# EAGLE schematic item_2022_02 (EAGLE 9.6.2)

## Sheet 1 of 2
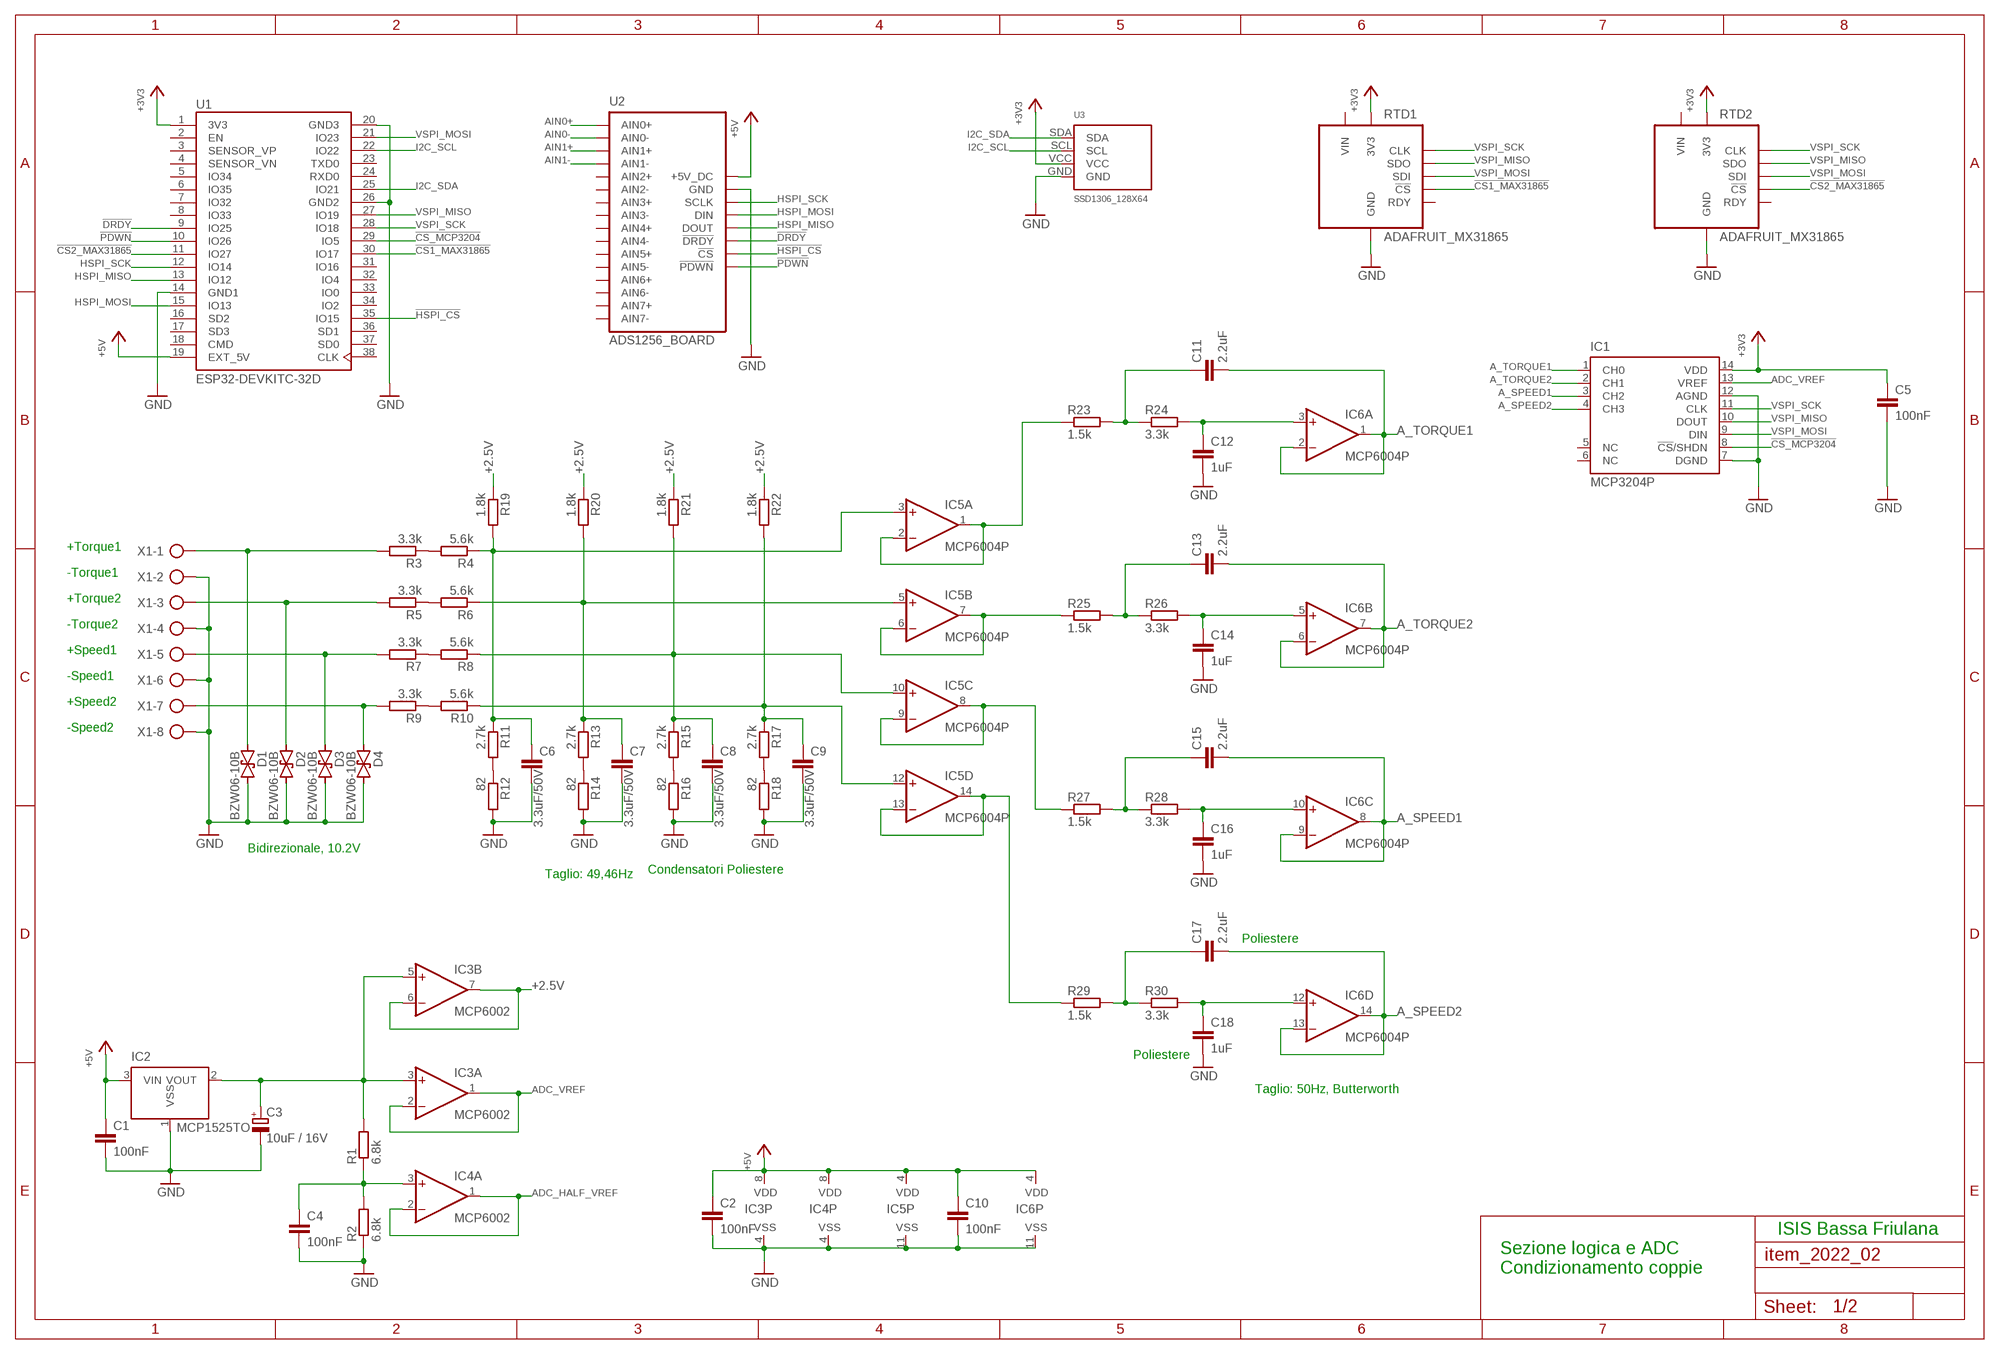
[diagram p0: schematic, sheet 1]

### Parts
C1  100nF  C-EU050-025X075  [C050-025X075]
C2  100nF  C-EU050-025X075  [C050-025X075]
C3  10uF / 16V  CPOL-EUE2.5-6  [E2,5-6]
C4  100nF  C-EU050-025X075  [C050-025X075]
C5  100nF  C-EU050-025X075  [C050-025X075]
C6  3.3uF/50V  C-EU050-030X075  [C050-030X075]
C7  3.3uF/50V  C-EU050-030X075  [C050-030X075]
C8  3.3uF/50V  C-EU050-030X075  [C050-030X075]
C9  3.3uF/50V  C-EU050-030X075  [C050-030X075]
C10  100nF  C-EU050-025X075  [C050-025X075]
C11  2.2uF  C-EU050-030X075  [C050-030X075]
C12  1uF  C-EU050-030X075  [C050-030X075]
C13  2.2uF  C-EU050-030X075  [C050-030X075]
C14  1uF  C-EU050-030X075  [C050-030X075]
C15  2.2uF  C-EU050-030X075  [C050-030X075]
C16  1uF  C-EU050-030X075  [C050-030X075]
C17  2.2uF  C-EU050-030X075  [C050-030X075]
C18  1uF  C-EU050-030X075  [C050-030X075]
D1  BZW06-10B  BZW04XXB  [F126Z12]
D2  BZW06-10B  BZW04XXB  [F126Z12]
D3  BZW06-10B  BZW04XXB  [F126Z12]
D4  BZW06-10B  BZW04XXB  [F126Z12]
IC1  MCP3204P  [DIL14]
IC2  MCP1525TO  [TO92]
IC3  MCP6002  [DIL08]
IC4  MCP6002  [DIL08]
IC5  MCP6004P  [DIL14]
IC6  MCP6004P  [DIL14]
R1  6.8k  R-EU_0207/10  [0207/10]
R2  6.8k  R-EU_0207/10  [0207/10]
R3  3.3k  R-EU_0207/10  [0207/10]
R4  5.6k  R-EU_0207/10  [0207/10]
R5  3.3k  R-EU_0207/10  [0207/10]
R6  5.6k  R-EU_0207/10  [0207/10]
R7  3.3k  R-EU_0207/10  [0207/10]
R8  5.6k  R-EU_0207/10  [0207/10]
R9  3.3k  R-EU_0207/10  [0207/10]
R10  5.6k  R-EU_0207/10  [0207/10]
R11  2.7k  R-EU_0207/10  [0207/10]
R12  82  R-EU_0207/10  [0207/10]
R13  2.7k  R-EU_0207/10  [0207/10]
R14  82  R-EU_0207/10  [0207/10]
R15  2.7k  R-EU_0207/10  [0207/10]
R16  82  R-EU_0207/10  [0207/10]
R17  2.7k  R-EU_0207/10  [0207/10]
R18  82  R-EU_0207/10  [0207/10]
R19  1.8k  R-EU_0207/10  [0207/10]
R20  1.8k  R-EU_0207/10  [0207/10]
R21  1.8k  R-EU_0207/10  [0207/10]
R22  1.8k  R-EU_0207/10  [0207/10]
R23  1.5k  R-EU_0207/10  [0207/10]
R24  3.3k  R-EU_0207/10  [0207/10]
R25  1.5k  R-EU_0207/10  [0207/10]
R26  3.3k  R-EU_0207/10  [0207/10]
R27  1.5k  R-EU_0207/10  [0207/10]
R28  3.3k  R-EU_0207/10  [0207/10]
R29  1.5k  R-EU_0207/10  [0207/10]
R30  3.3k  R-EU_0207/10  [0207/10]
RTD1  ADAFRUIT_MX31865  [ADAFRUIT_MAX31865]
RTD2  ADAFRUIT_MX31865  [ADAFRUIT_MAX31865]
U1  ESP32-DEVKITC-32D  [MODULE_ESP32-DEVKITC-32D]
U2  ADS1256_BOARD  [ADS1256_BOARD]
U3  SSD1306_128X64  [128X64]
X1  AK500/8  [AK500/8]

### Nets
!CS1_MAX31865!: RTD1.P7(!CS!) U1.30(IO17)
!CS2_MAX31865!: RTD2.P7(!CS!) U1.11(IO27)
!CS_MCP3204!: IC1.8(!CS!/SHDN) U1.29(IO5)
!DRDY!: U1.9(IO25) U2.!DRDY!
!HSPI_CS!: U1.35(IO15) U2.!CS!
!PDWN!: U1.10(IO26) U2.PDWN(!PDWN!)
+2.5V: IC3.6(B:-IN) IC3.7(B:OUT) R19.1 R20.1 R21.1 R22.1
+3V3: C5.1 IC1.14(VDD) RTD1.P3(3V3) RTD2.P3(3V3) U1.1(3V3) U3.VCC
+5V: C1.1 C2.1 C10.1 IC2.3(VIN) IC3.8(P:VDD) IC4.8(P:VDD) IC5.4(P:VDD) IC6.4(P:VDD) U1.19(EXT_5V) U2.5V_DC(+5V_DC)
A_SPEED1: C15.2 IC1.3(CH2) IC6.8(C:OUT) IC6.9(C:-IN)
A_SPEED2: C17.2 IC1.4(CH3) IC6.13(D:-IN) IC6.14(D:OUT)
A_TORQUE1: C11.2 IC1.1(CH0) IC6.1(A:OUT) IC6.2(A:-IN)
A_TORQUE2: C13.2 IC1.2(CH1) IC6.6(B:-IN) IC6.7(B:OUT)
ADC_HALF_VREF: IC4.1(A:OUT) IC4.2(A:-IN)
ADC_VREF: IC1.13(VREF) IC3.1(A:OUT) IC3.2(A:-IN)
AIN0+: U2.AIN0+
AIN0-: U2.AIN0-
AIN1+: U2.AIN1+
AIN1-: U2.AIN1-
GND: C1.2 C2.2 C3.- C4.2 C5.2 C6.2 C7.2 C8.2 C9.2 C10.2 C12.2 C14.2 C16.2 C18.2 D1.C D2.C D3.C D4.C IC1.7(DGND) IC1.12(AGND) IC2.1(VSS) IC3.4(P:VSS) IC4.4(P:VSS) IC5.11(P:VSS) IC6.11(P:VSS) R2.1 R12.2 R14.2 R16.2 R18.2 RTD1.P2(GND) RTD2.P2(GND) U1.14(GND1) U1.20(GND3) U1.26(GND2) U2.GND U3.GND X1.2 X1.4 X1.6 X1.8
HSPI_MISO: U1.13(IO12) U2.DOUT
HSPI_MOSI: U1.15(IO13) U2.DIN
HSPI_SCK: U1.12(IO14) U2.SCLK
I2C_SCL: U1.22(IO22) U3.SCL
I2C_SDA: U1.25(IO21) U3.SDA
N$1: C3.+ IC2.2(VOUT) IC3.3(A:+IN) IC3.5(B:+IN) R1.2
N$2: D1.A R3.2 X1.1
N$3: C4.1 IC4.3(A:+IN) R1.1 R2.2
N$4: D2.A R5.2 X1.3
N$5: D3.A R7.2 X1.5
N$6: D4.A R9.2 X1.7
N$7: R3.1 R4.2
N$8: R5.1 R6.2
N$9: R7.1 R8.2
N$10: R9.1 R10.2
N$11: R11.2 R12.1
N$12: C6.1 IC5.3(A:+IN) R4.1 R11.1 R19.2
N$13: R13.2 R14.1
N$14: R15.2 R16.1
N$15: R17.2 R18.1
N$16: C7.1 IC5.5(B:+IN) R6.1 R13.1 R20.2
N$17: C8.1 IC5.10(C:+IN) R8.1 R15.1 R21.2
N$18: C9.1 IC5.12(D:+IN) R10.1 R17.1 R22.2
N$19: IC5.1(A:OUT) IC5.2(A:-IN) R23.1
N$20: IC5.6(B:-IN) IC5.7(B:OUT) R25.1
N$21: IC5.8(C:OUT) IC5.9(C:-IN) R27.1
N$22: IC5.13(D:-IN) IC5.14(D:OUT) R29.1
N$23: C11.1 R23.2 R24.1
N$24: C12.1 IC6.3(A:+IN) R24.2
N$26: C13.1 R25.2 R26.1
N$27: C14.1 IC6.5(B:+IN) R26.2
N$29: C15.1 R27.2 R28.1
N$30: C16.1 IC6.10(C:+IN) R28.2
N$32: C17.1 R29.2 R30.1
N$33: C18.1 IC6.12(D:+IN) R30.2
VSPI_MISO: IC1.10(DOUT) RTD1.P5(SDO) RTD2.P5(SDO) U1.27(IO19)
VSPI_MOSI: IC1.9(DIN) RTD1.P6(SDI) RTD2.P6(SDI) U1.21(IO23)
VSPI_SCK: IC1.11(CLK) RTD1.P4(CLK) RTD2.P4(CLK) U1.28(IO18)
Unconnected: IC1.5(NC) IC1.6(NC) IC4.5(B:+IN) IC4.6(B:-IN) IC4.7(B:OUT) RTD1.P8(RDY) RTD2.P8(RDY) U1.2(EN) U1.3(SENSOR_VP) U1.4(SENSOR_VN) U1.5(IO34) U1.6(IO35) U1.7(IO32) U1.8(IO33) U1.16(SD2) U1.17(SD3) U1.18(CMD) U1.23(TXD0) U1.24(RXD0) U1.31(IO16) U1.32(IO4) U1.33(IO0) U1.34(IO2) U1.36(SD1) U1.37(SD0) U1.38(CLK) U2.AIN2+ U2.AIN2- U2.AIN3+ U2.AIN3- U2.AIN4+ U2.AIN4- U2.AIN5+ U2.AIN5- U2.AIN6+ U2.AIN6- U2.AIN7+ U2.AIN7-

### Notes on the sheet
- +Torque1
- -Torque1
- +Torque2
- -Torque2
- +Speed1
- -Speed1
- +Speed2
- -Speed2
- Bidirezionale, 10.2V
- Taglio: 49,46Hz | Condensatori Poliestere
- Poliestere
- Poliestere
- Taglio: 50Hz, Butterworth
- ISIS Bassa Friulana
- Sezione logica e ADC
  Condizionamento coppie

## Sheet 2 of 2
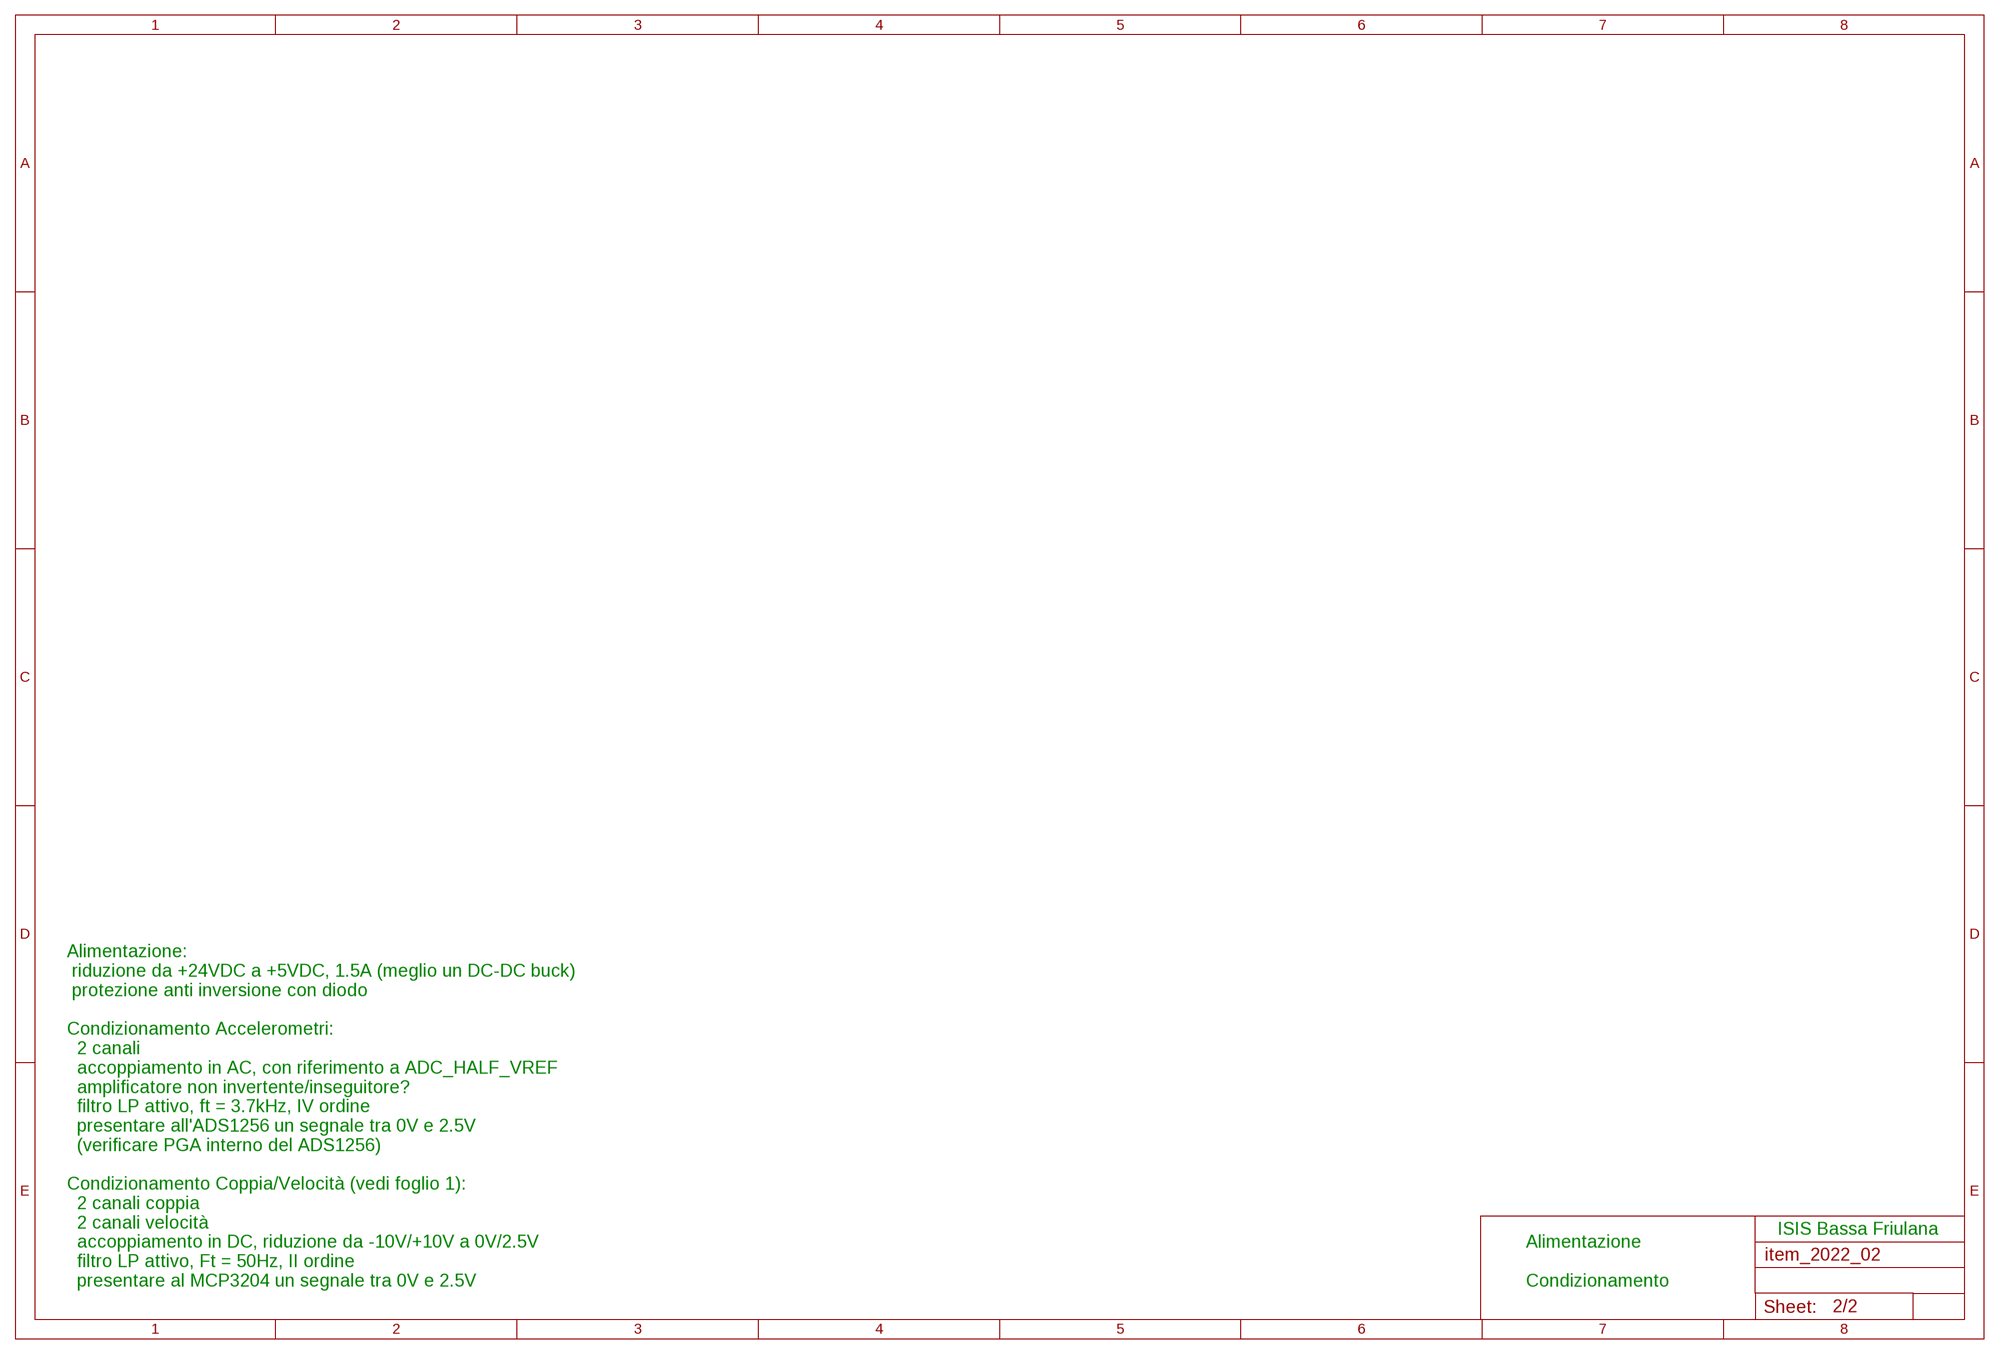
[diagram p1: schematic, sheet 2]

### Notes on the sheet
- ISIS Bassa Friulana
- Alimentazione:
   riduzione da +24VDC a +5VDC, 1.5A (meglio un DC-DC buck)
   protezione anti inversione con diodo
  
  Condizionamento Accelerometri:
    2 canali
    accoppiamento in AC, con riferimento a ADC_HALF_VREF
    amplificatore non invertente/inseguitore?
    filtro LP attivo, ft = 3.7kHz, IV ordine
    presentare all'ADS1256 un segnale tra 0V e 2.5V
    (verificare PGA interno del ADS1256)
  
  Condizionamento Coppia/Velocità (vedi foglio 1):
    2 canali coppia
    2 canali velocità
    accoppiamento in DC, riduzione da -10V/+10V a 0V/2.5V
    filtro LP attivo, Ft = 50Hz, II ordine
    presentare al MCP3204 un segnale tra 0V e 2.5V
- Alimentazione
  
  Condizionamento

## Power pins joined to a net without a drawn wire
VIN: RTD1.P1(VIN) RTD2.P1(VIN)

## Library data of the parts
C1 C2 C4 C5 C10 = rcl_LargePads:C-EU: CAPACITOR, European symbol
C3 = rcl_LargePads:CPOL-EU: POLARIZED CAPACITOR, European symbol
C6-C9 = rcl_LargePads:C-EU: CAPACITOR, European symbol; TME_EU: MKS2B043301H00KSSD
C11 C13 C15 C17 = rcl_LargePads:C-EU: CAPACITOR, European symbol; TME_EU: MKS2B042201F00KSSD
C12 C14 C16 C18 = rcl_LargePads:C-EU: CAPACITOR, European symbol; TME_EU: B32529C0105J189
D1-D4 = diode_LargePads:BZW04XXB: DIODE uni and bidirectional supressor diode
IC1 = MCP3204_MCP3208:MCP3204: MCP3204 - 2.7V 4-Channel 12-Bit A/D Converters with SPI Serial Interface
IC2 = MCP1525_MCP1541:MCP1525: MCP1525 - 2.5V Precision Voltage Reference
IC3 IC4 = MCP6002_MCP6004:MCP6002: MCP6002 - 1 MHz, Low-Power dual Op Amp, Rail-to-Rail Input/Output, Supply Voltage: 1.8V to 6.0V
IC5 IC6 = MCP6002_MCP6004:MCP6004: MCP6004 - 1 MHz, Low-Power quad Op Amp, Rail-to-Rail Input/Output, Supply Voltage: 1.8V to 6.0V
R1-R30 = rcl_LargePads:R-EU_: RESISTOR, European symbol
RTD1 RTD2 = Adafruit_MAX31865_RTD:ADAFRUIT_MX31865: Adafruit MAX31865 - Adafruit MAX31865 RTD PT100 or PT1000 Amplifier
U1 = ESP32-DEVKITC-32D:ESP32-DEVKITC-32D: Eval Board For Esp-Wroom-32 Check prices <https://pricing.snapeda.com/parts/ESP32-DEVKITC-32D/Espressif%20Systems/view-part?ref=eda>; AVAILABILITY: Warning; DESCRIPTION: WiFi Development Tools (802.11) ESP32 General Development Kit, ESP32-WROOM-32D on the board; MF: Espressif Systems; MP: ESP32-DEVKITC-32D; PACKAGE: None; PRICE: None; PURCHASE-URL: https://pricing.snapeda.com/search/part/ESP32-DEVKITC-32D/?ref=eda
U2 = ADS1256:ADS1256_BOARD: Board 8 Channels - ADS1256 24bit
U3 = ssd1306oled:SSD1306_128X64: OLED Display Board 0.91" 128x64 White I2C - 4 Pins - SSD1306
X1 = con-ptr500:AK500/8: CONNECTOR; OC_FARNELL: unknown; OC_NEWARK: unknown